# Altium schematic sheet CPU_Logic.SchDoc: Title
size A1; Date: Date; CompanyName: Integrated Micro-Electronics Bulgaria; Organization: Design & Development Department; Address1: Drawing Type; Address2: Address 1; Address3: Address 2; Address4: Address 3; DocumentNumber: 730xxx; Revision: 01; SheetNumber: 1; SheetTotal: 1; PageSetup: Record=PageOptions|CenterHorizontal=True|CenterVertical=True|PrintScale=0.70|XCorrection=1.00|YCorrection=1.00|PrintKind=2|BorderSize=5000000|LeftOffset=0|BottomOffset=0|Orientation=2|PaperLength=1000|PaperWidth=1000|Scale=100|PaperSource=7|PrintQuality=-4|MediaType=1|DitherType=10|PaperKind=A4|PrintScaleMode=1; SheetSize: A3; Time: Time; ModifiedDate: Mod. Date
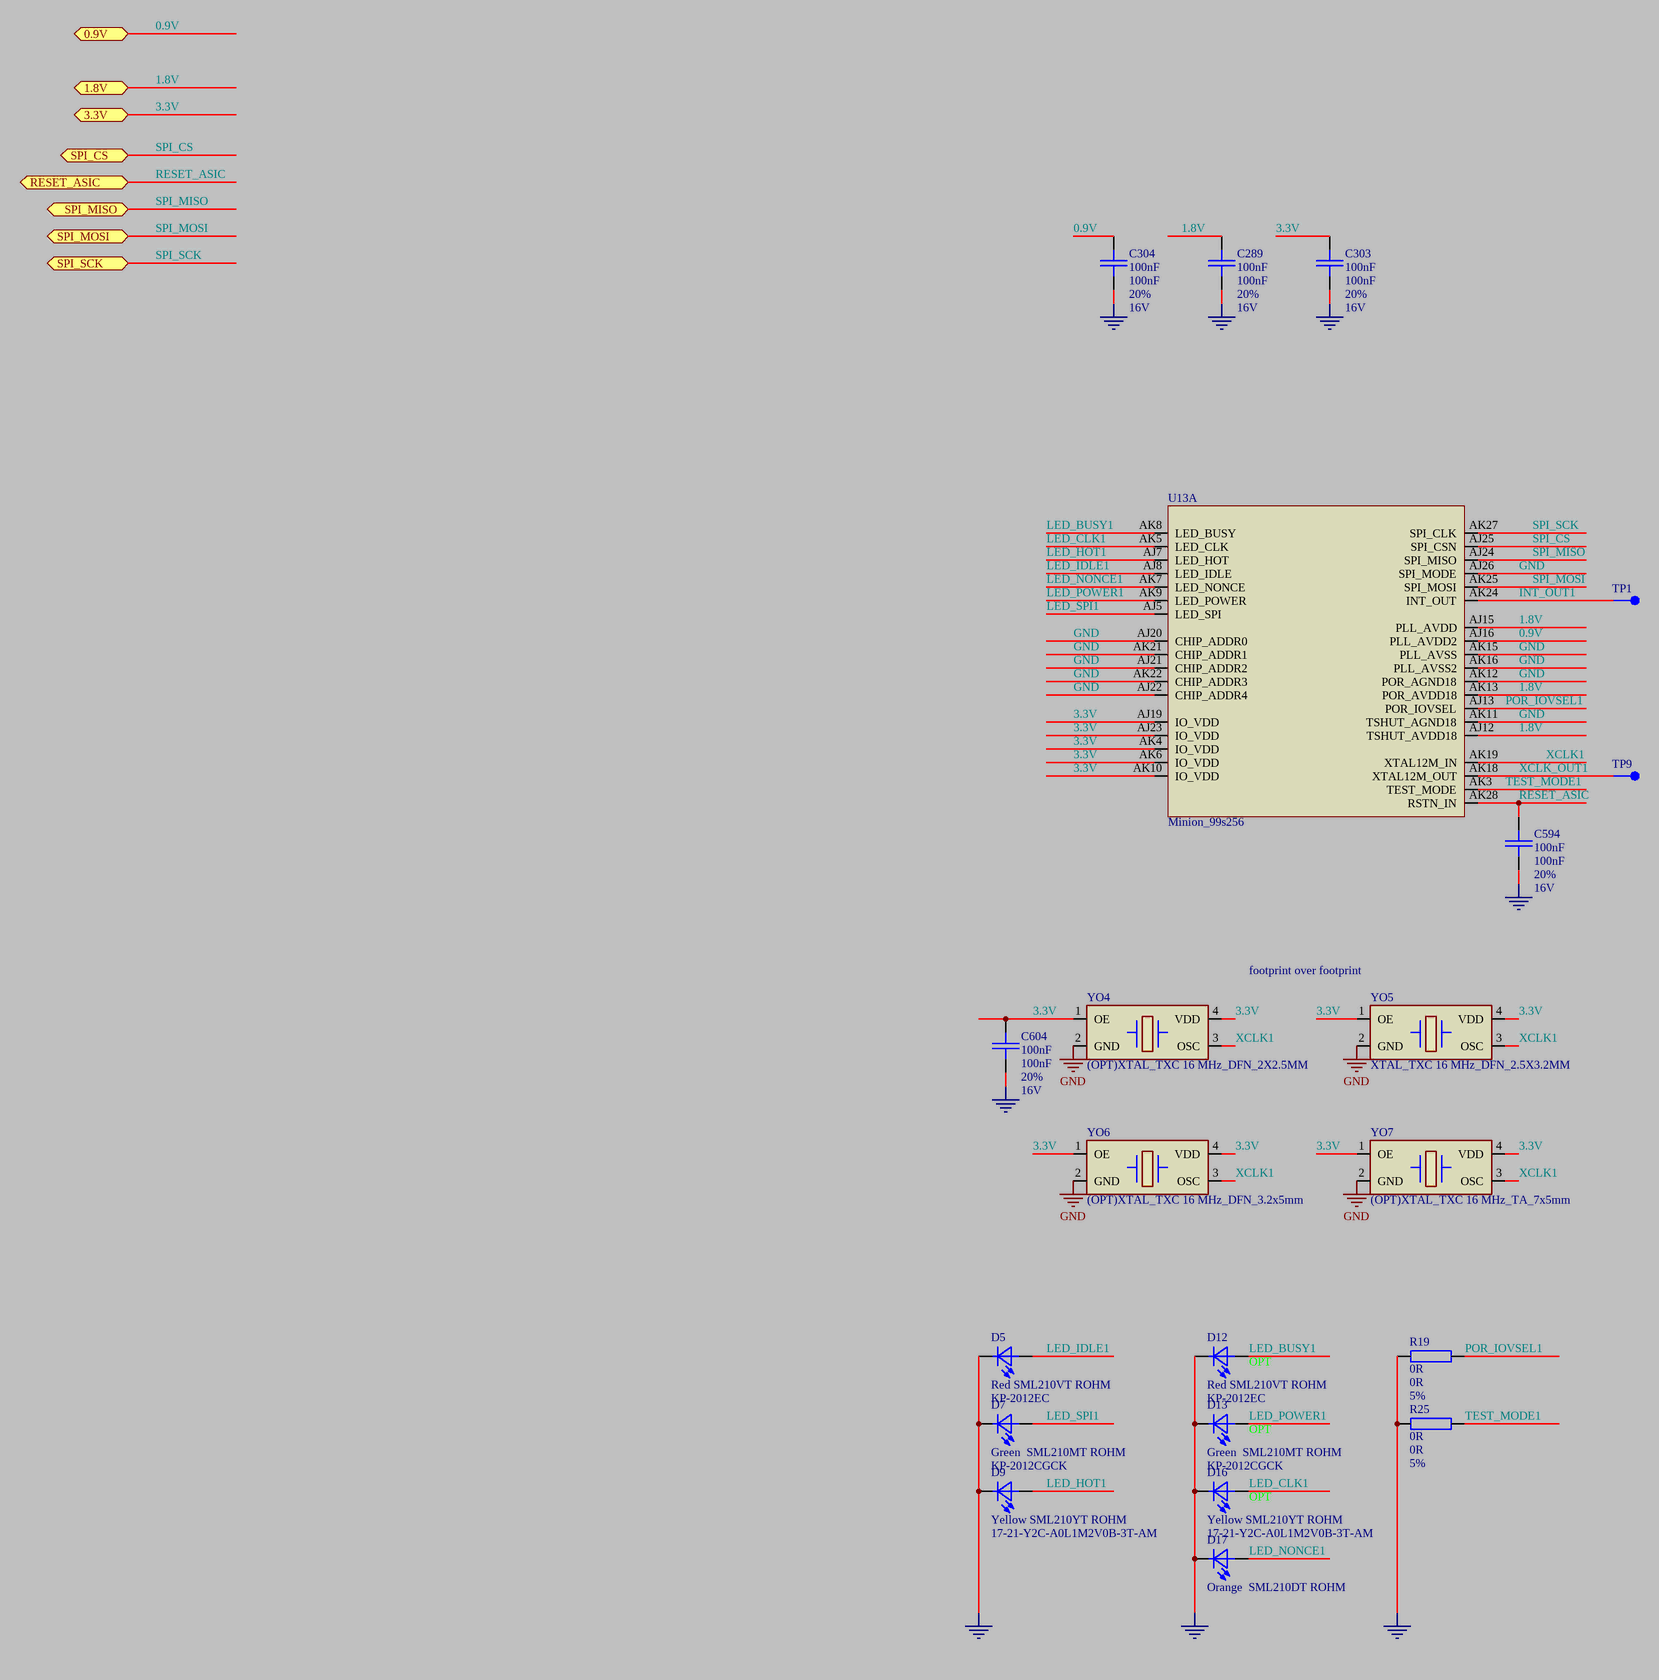
[diagram p0: CPU_Logic.SchDoc]

## Parts
C289  100nF  DB_TOLERANCE: 20%  DB_VOLTAGE: 16V  [SMD_0603_CAPC1608X95N]
C303  100nF  DB_TOLERANCE: 20%  DB_VOLTAGE: 16V  [SMD_0603_CAPC1608X95N]
C304  100nF  DB_TOLERANCE: 20%  DB_VOLTAGE: 16V  [SMD_0603_CAPC1608X95N]
C594  100nF  DB_TOLERANCE: 20%  DB_VOLTAGE: 16V  [SMD_0603_CAPC1608X95N]
C604  100nF  DB_TOLERANCE: 20%  DB_VOLTAGE: 16V  [SMD_0603_CAPC1608X95N]
D5  Red SML210VT ROHM  DB_VALUE: KP-2012EC  [SMD_0805_LED2012X100N]
D7  Green  SML210MT ROHM  DB_VALUE: KP-2012CGCK  [SMD_0805_LED2012X100N]
D9  Yellow SML210YT ROHM  DB_VALUE: 17-21-Y2C-A0L1M2V0B-3T-AM  [SMD_0805_LED2012X100N]
D12  Red SML210VT ROHM  DB_VALUE: KP-2012EC  [SMD_0805_LED2012X100N]
D13  Green  SML210MT ROHM  DB_VALUE: KP-2012CGCK  [SMD_0805_LED2012X100N]
D16  Yellow SML210YT ROHM  DB_VALUE: 17-21-Y2C-A0L1M2V0B-3T-AM  [SMD_0805_LED2012X100N]
D17  Orange  SML210DT ROHM  [SMD_0805_LED2012X100N]
R19  0R  DB_TOLERANCE: 5%  [SMD_0603_RESC1608X55N]
R25  0R  DB_TOLERANCE: 5%  [SMD_0603_RESC1608X55N]
TP1  TEST_POINT_1  [SMD_TP_100-254]  (value not drawn)
TP9  TEST_POINT_1  [SMD_TP_100-254]  (value not drawn)
U13  Minion_99s256  [SMD_BGA900C80P30X30]  (part A of 3)
YO4  (OPT)XTAL_TXC 16 MHz_DFN_2X2.5MM  [SMD_OSCCF200X250X90-4N]
YO5  XTAL_TXC 16 MHz_DFN_2.5X3.2MM  [SMD_OSCCF250X320X90-4N]
YO6  (OPT)XTAL_TXC 16 MHz_DFN_3.2x5mm  [SMD_OSCCF320X400X90-4N]
YO7  (OPT)XTAL_TXC 16 MHz_TA_7x5mm  [SMD_OSCCC500X700X100-4N]

## Ports
0.9V, 1.8V, 3.3V, RESET_ASIC, SPI_CS, SPI_MISO, SPI_MOSI, SPI_SCK

## Nets
GND: C289.1 C303.1 C304.1 C594.2 C604.2 D5.1(C) D7.1(C) D9.1(C) D12.1(C) D13.1(C) D16.1(C) D17.1(C) R19.1 R25.1 U13.AJ20(CHIP_ADDR0) U13.AJ21(CHIP_ADDR2) U13.AJ22(CHIP_ADDR4) U13.AJ26(SPI_MODE) U13.AK11(TSHUT_AGND18) U13.AK12(POR_AGND18) U13.AK15(PLL_AVSS) U13.AK16(PLL_AVSS2) U13.AK21(CHIP_ADDR1) U13.AK22(CHIP_ADDR3) YO4.2(GND) YO5.2(GND) YO6.2(GND) YO7.2(GND)
0.9V: C304.2 U13.AJ16(PLL_AVDD2) ; port 0.9V
1.8V: C289.2 U13.AJ12(TSHUT_AVDD18) U13.AJ15(PLL_AVDD) U13.AK13(POR_AVDD18) ; port 1.8V
3.3V: C303.2 C604.1 U13.AJ19(IO_VDD) U13.AJ23(IO_VDD) U13.AK4(IO_VDD) U13.AK6(IO_VDD) U13.AK10(IO_VDD) YO4.1(OE) YO4.4(VDD) YO5.1(OE) YO5.4(VDD) YO6.1(OE) YO6.4(VDD) YO7.1(OE) YO7.4(VDD) ; port 3.3V
INT_OUT1: TP1.1 U13.AK24(INT_OUT)
LED_BUSY1: D12.2(A) U13.AK8(LED_BUSY)
LED_CLK1: D16.2(A) U13.AK5(LED_CLK)
LED_HOT1: D9.2(A) U13.AJ7(LED_HOT)
LED_IDLE1: D5.2(A) U13.AJ8(LED_IDLE)
LED_NONCE1: D17.2(A) U13.AK7(LED_NONCE)
LED_POWER1: D13.2(A) U13.AK9(LED_POWER)
LED_SPI1: D7.2(A) U13.AJ5(LED_SPI)
POR_IOVSEL1: R19.2 U13.AJ13(POR_IOVSEL)
RESET_ASIC: C594.1 U13.AK28(RSTN_IN) ; port RESET_ASIC
SPI_CS: U13.AJ25(SPI_CSN) ; port SPI_CS
SPI_MISO: U13.AJ24(SPI_MISO) ; port SPI_MISO
SPI_MOSI: U13.AK25(SPI_MOSI) ; port SPI_MOSI
SPI_SCK: U13.AK27(SPI_CLK) ; port SPI_SCK
TEST_MODE1: R25.2 U13.AK3(TEST_MODE)
XCLK1: U13.AK19(XTAL12M_IN) YO4.3(OSC) YO5.3(OSC) YO6.3(OSC) YO7.3(OSC)
XCLK_OUT1: TP9.1 U13.AK18(XTAL12M_OUT)

## Notes on the sheet
- footprint over footprint
- (near D12) OPT
- (near D13) OPT
- (near D16) OPT

## Library data of the parts
C289 C303 C304 C594 C604 = CAP000027236: DB_PART_TYPE: Ceramic_SMD\Standard_X7R; DB_MANUFACTURER_PART: KEMET    C0603C104M4RAC; NOTE: <NOTE>; DB_T_RANGE: -55 to 125; DB_PACKAGE: 0603; DB_DESCRIPTION: C X7R 100nF 20% 16V 0603; DB_CERTIFIED: ISHIDDEN=T; DB_APPROVED_ON: 09.10.2010 г.; DB_STATUS: NEW; DB_PART_NUMBER: CAP000027236; DB_VALUE: 100nF; DB_PCB_DEVICE: SMD_0603_CAPC1608X95N; DB_PRICE: ISHIDDEN=T; DB_LEADTIME: ISHIDDEN=T; DB_MOQ: ISHIDDEN=T; DB_PRICE_DATE: ISHIDDEN=T; DB_APPROVED_BY: ISHIDDEN=T; DB_DATASHEET: http://john.epiqdesign.com/projects/CIS_Datasheets/F3102_CE_Kemet.pdf?rev=92&sc=0
D5 D12 = OPT000000095: DB_MANUFACTURER_PART: KINGBRIGHT       KP-2012EC; NOTE: <NOTE>; DB_T_RANGE: -40 to 85; DB_PACKAGE: 0805; DB_DESCRIPTION: LED RED 0805; DB_CERTIFIED: ISHIDDEN=T; DB_APPROVED_BY: VSN; DB_APPROVED_ON: 08.4.2014 г. 09:20:29; DB_STATUS: NEW; DB_PCB_DEVICE: SMD_0805_LED2012X100N; DB_PART_NUMBER: OPT000000095; DB_PART_TYPE: LED; DB_COLOUR: RED; DB_DATASHEET: http://john.epiqdesign.com/projects/CIS_Datasheets/LED_KP-2012EC_0805_RED.pdf?rev=1358&sc=0
D7 D13 = OPT000000096: DB_MANUFACTURER_PART: KINGBRIGHT       KP-2012CGCK; NOTE: <NOTE>; DB_T_RANGE: -40 to 85; DB_PACKAGE: 0805; DB_DESCRIPTION: LED GREEN 0805; DB_CERTIFIED: ISHIDDEN=T; DB_APPROVED_BY: VSN; DB_APPROVED_ON: 08.4.2014 г. 09:22:12; DB_STATUS: NEW; DB_PCB_DEVICE: SMD_0805_LED2012X100N; DB_PART_NUMBER: OPT000000096; DB_PART_TYPE: LED; DB_COLOUR: GREEN; DB_DATASHEET: http://john.epiqdesign.com/projects/CIS_Datasheets/LED_KP-2012CGCK_0805_GREEN.pdf?rev=1359&sc=0
D9 D16 = OPT000000092: DB_MANUFACTURER_PART: EVERLIGHT       17-21-Y2C-A0L1M2V0B-3T-AM; NOTE: <NOTE>; DB_T_RANGE: -40 to 100; DB_PACKAGE: 0805; DB_DESCRIPTION: LED YELLOW 0805; DB_CERTIFIED: AUT; DB_APPROVED_BY: VSN; DB_APPROVED_ON: 17.6.2013 г. 13:21:58; DB_STATUS: NEW; DB_PCB_DEVICE: SMD_0805_LED2012X100N; DB_PART_NUMBER: OPT000000092; DB_PART_TYPE: LED; DB_COLOUR: YELLOW; DB_DATASHEET: http://john.epiqdesign.com/projects/CIS_Datasheets/LED_17-21-Y2C-A0L1M2V0B-3T-AM.pdf?rev=1220&sc=0
D17 = OPT000000096: DB_PART_TYPE: LED; DB_MANUFACTURER_PART: KINGBRIGHT       KP-2012CGCK; NOTE: <NOTE>; DB_T_RANGE: -40 to 85; DB_COLOUR: GREEN; DB_PACKAGE: 0805; DB_DESCRIPTION: LED GREEN 0805; DB_CERTIFIED: ISHIDDEN=T; DB_APPROVED_BY: VSN; DB_APPROVED_ON: 08.4.2014 г. 09:22:12; DB_STATUS: NEW; DB_VALUE: KP-2012CGCK; DB_PCB_DEVICE: SMD_0805_LED2012X100N; DB_PART_NUMBER: OPT000000096; DB_DATASHEET: http://john.epiqdesign.com/projects/CIS_Datasheets/LED_KP-2012CGCK_0805_GREEN.pdf?rev=1359&sc=0
R19 R25 = RES000006349: DB_PART_TYPE: SMD; DB_MANUFACTURER_PART: YAGEO    RC0603JR-070R; NOTE: <NOTE>; DB_T_RANGE: -55 to 155; DB_POWER: 1/10W; DB_PACKAGE: 0603; DB_DESCRIPTION: R SMD 0R 5% 1/10W 0603; DB_CERTIFIED: ISHIDDEN=T; DB_PRICE: 0.000364; DB_MOQ: 5000; DB_APPROVED_ON: 09.10.2010 г.; DB_STATUS: NEW; R_BDS: R; DB_PART_NUMBER: RES000006349; DB_VALUE: 0R; DB_PCB_DEVICE: SMD_0603_RESC1608X55N; DB_PRICE_DATE: 2010-12-23; DB_APPROVED_BY: ISHIDDEN=T; DB_DATASHEET: http://john.epiqdesign.com/projects/CIS_Datasheets/PYu-RC0603_51_RoHS_L_4_YAGEO.pdf?rev=138&sc=0
TP1 TP9 = TPO000000001: DB_PART_TYPE: Test Point; DB_VALUE: 100_254; DB_PACKAGE: ISHIDDEN=T; DB_DESCRIPTION: Test Point 100_254; DB_APPROVED_ON: 10.9.2010 г.; DB_STATUS: NEW; DB_PART_NUMBER: TPO000000001; DB_DIAMETER: 100_254; DB_PCB_DEVICE: SMD_TP_100-254; DB_MANUFACTURER_PART: ISHIDDEN=T; DB_CERTIFIED: ISHIDDEN=T; DB_PRICE: ISHIDDEN=T; DB_LEADTIME: ISHIDDEN=T; DB_MOQ: ISHIDDEN=T; DB_PRICE_DATE: ISHIDDEN=T; DB_APPROVED_BY: ISHIDDEN=T; DB_DATASHEET: ISHIDDEN=T
YO4 = SMD_OSC_DFN_2X2.5MM: NOTE: <NOTE>; DB_PCB_DEVICE: SMD_OSCCF200X250X90-4N
YO5 = SMD_OSC_DFN_2.5X3.2MM: NOTE: <NOTE>; DB_PCB_DEVICE: SMD_OSCCF250X320X90-4N
YO6 = SMD_OSC_DFN_3.2x5mm: NOTE: <NOTE>; DB_PCB_DEVICE: SMD_OSCCF320X400X90-4N
YO7 = SMD_OSC_TA_7x5mm: NOTE: <NOTE>; DB_PCB_DEVICE: SMD_OSCCC500X700X100-4N
U13 = Minion_99s256: DB_PCB_DEVICE: SMD_BGA900C80P30X30